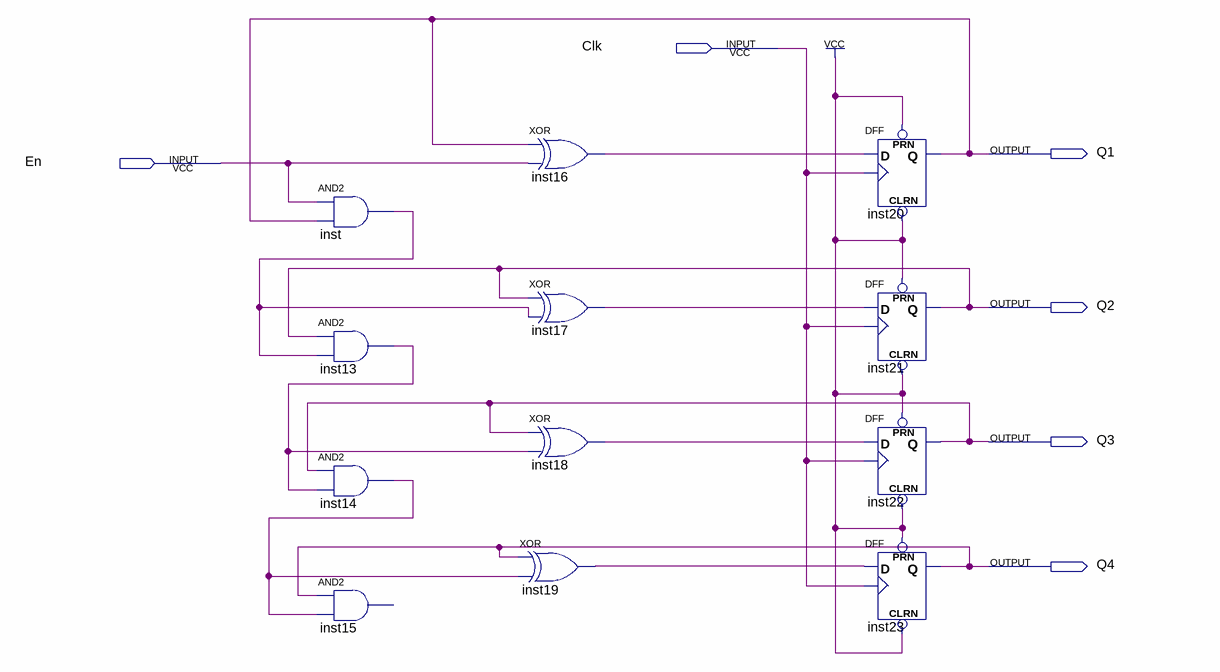
[diagram p0: schematic sheet]
// Quartus schematic lab10step2a.bdf as structural Verilog: 12 symbols, 6 pins
module lab10step2a (
  input  Clk,
  input  En,
  output Q1,
  output Q2,
  output Q3,
  output Q4
);

  wire inst13_out, inst14_out, inst16_out, inst17_out, inst18_out, inst19_out, inst_out;

  and inst (inst_out, En, Q1);
  and inst13 (inst13_out, Q2, inst_out);
  and inst14 (inst14_out, Q3, inst13_out);
  // AND2 inst15 has open pins: IN1=Q4, IN2=inst14_out, OUT=open
  xor inst16 (inst16_out, Q1, En);
  xor inst17 (inst17_out, Q2, inst_out);
  xor inst18 (inst18_out, Q3, inst13_out);
  xor inst19 (inst19_out, Q4, inst14_out);
  DFF inst20 (.CLRN(1'b1), .CLK(Clk), .D(inst16_out), .PRN(1'b1), .Q(Q1));
  DFF inst21 (.CLRN(1'b1), .CLK(Clk), .D(inst17_out), .PRN(1'b1), .Q(Q2));
  DFF inst22 (.CLRN(1'b1), .CLK(Clk), .D(inst18_out), .PRN(1'b1), .Q(Q3));
  DFF inst23 (.CLRN(1'b1), .CLK(Clk), .D(inst19_out), .PRN(1'b1), .Q(Q4));
endmodule
